# EAGLE design alarm1 (EAGLE 6.3)
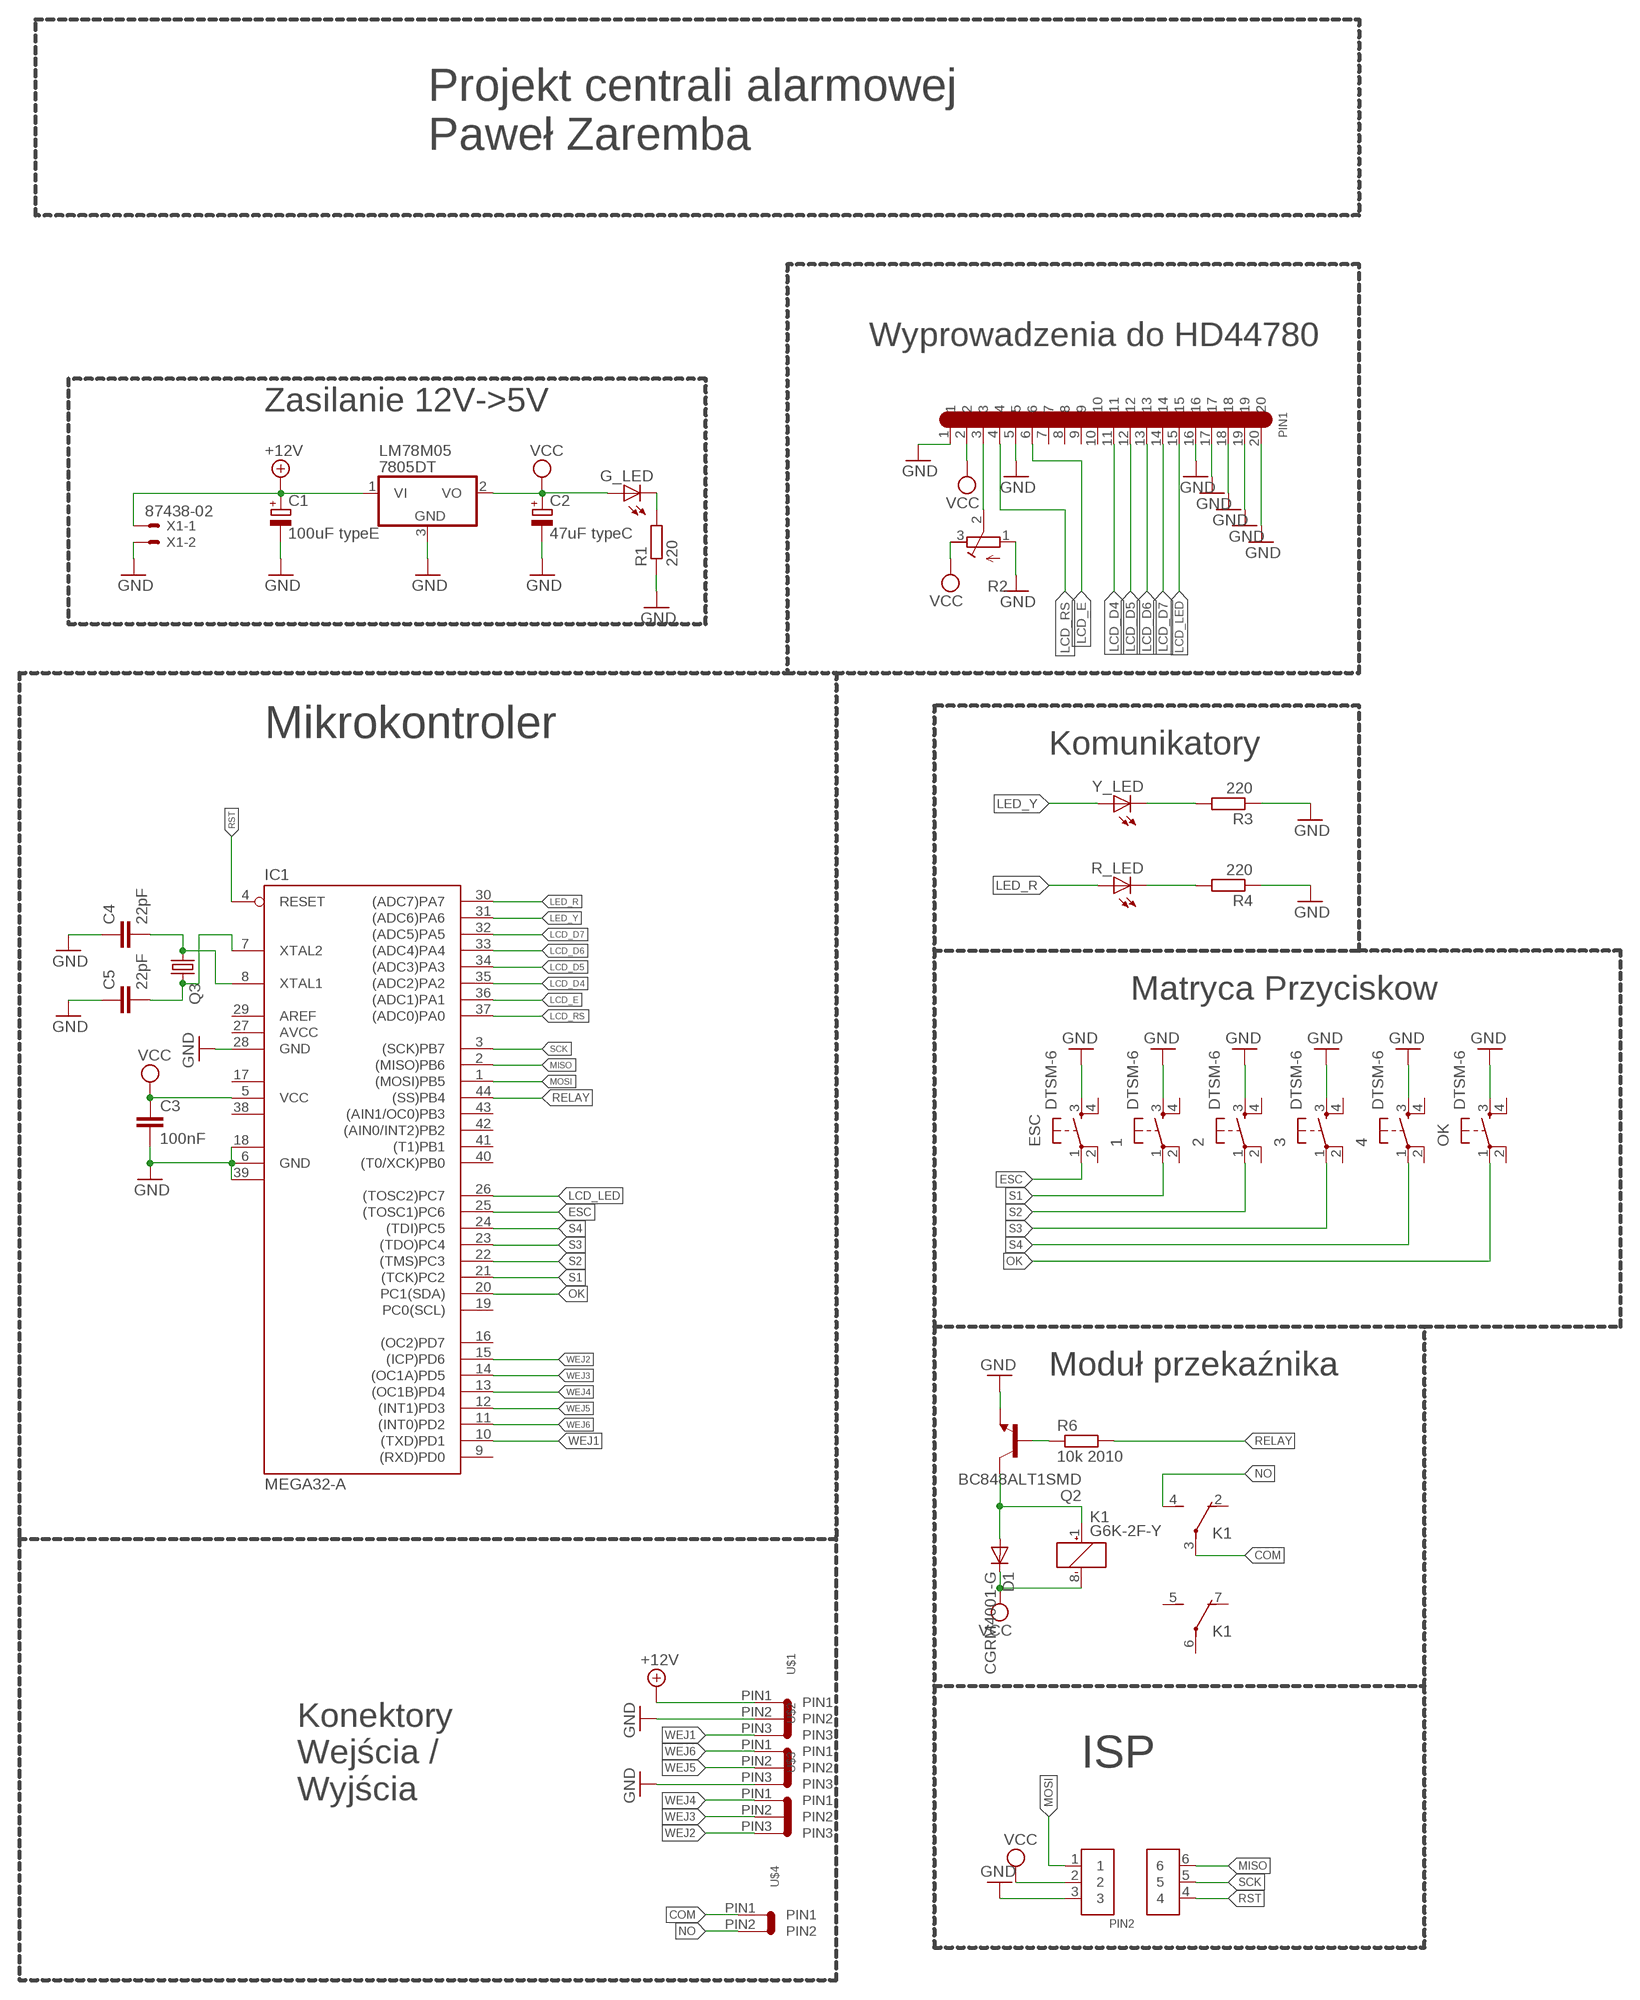
[diagram p0: schematic, sheet 1]

## Parts
1  DTSM-6  [DTSM-6]
2  DTSM-6  [DTSM-6]
3  DTSM-6  [DTSM-6]
4  DTSM-6  [DTSM-6]
C1  100uF typeE  CPOL-EUE  [PANASONIC_E]
C2  47uF typeC  CPOL-EUC  [PANASONIC_C]
C3  100nF  C-EUC1206  [C1206]
C4  22pF  C-EUC1206  [C1206]
C5  22pF  C-EUC1206  [C1206]
D1  CGRM4001-G  [SOD-123_MINI-SMA]
ESC  DTSM-6  [DTSM-6]
G_LED  LEDCHIPLED_1206  [CHIPLED_1206]
IC1  MEGA32-A  [TQFP44]
K1  G6K-2F-Y  [G6K-2F-Y]
LM78M05  7805DT  [TO252]
OK  DTSM-6  [DTSM-6]
PIN1  SINGLE1X20  [SINGLE1X20]
PIN2  2X3_GOLDPIN  [GOLD2X3]
Q2  BC848ALT1SMD  [SOT23]
Q3  CRYSTALHC49UP  [HC49UP]
R1  220  R-EU_R1206  [R1206]
R2  R-TRIMM3314J  [RTRIM3314J]
R3  220  R-EU_R1206  [R1206]
R4  220  R-EU_R1206  [R1206]
R6  10k 2010  R-EU_R2010  [R2010]
R_LED  LEDCHIPLED_1206  [CHIPLED_1206]
U$1  GOLDPIN_SMD_1X3  [GOLDPINSMD1X3]
U$2  GOLDPIN_SMD_1X3  [GOLDPINSMD1X3]
U$3  GOLDPIN_SMD_1X3  [GOLDPINSMD1X3]
U$4  GOLDPIN_SMD_1X2  [GOLDPINSMD1X2]
X1  87438-02  [87438-02]
Y_LED  LEDCHIPLED_1206  [CHIPLED_1206]

## Nets
+12V: C1.+ LM78M05.1(VI) U$1.PIN1 X1.1
COM: K1.3(2:P) U$4.PIN1
CRYSTAL_L: C5.2 IC1.7(XTAL2) Q3.2
CRYSTAL_R: C4.2 IC1.8(XTAL1) Q3.1
ESC: ESC.1 IC1.25((TOSC1)PC6)
GND: 1.3 2.3 3.3 4.3 C1.- C2.- C3.2 C4.1 C5.1 ESC.3 IC1.6(GND) IC1.18(GND1) IC1.28(GND) IC1.39(GND2) LM78M05.3(GND) OK.3 PIN1.1 PIN1.5 PIN1.16 PIN1.17 PIN1.18 PIN1.19 PIN1.20 PIN2.3 Q2.2(E) R1.1 R2.1(E) R3.1 R4.1 U$1.PIN2 U$2.PIN3 X1.2
LCD_D4: IC1.35((ADC2)PA2) PIN1.11
LCD_D5: IC1.34((ADC3)PA3) PIN1.12
LCD_D6: IC1.33((ADC4)PA4) PIN1.13
LCD_D7: IC1.32((ADC5)PA5) PIN1.14
LCD_E: IC1.36((ADC1)PA1) PIN1.6
LCD_LED: IC1.26((TOSC2)PC7) PIN1.15
LCD_RS: IC1.37((ADC0)PA0) PIN1.4
LED_R: IC1.30((ADC7)PA7) R_LED.A
LED_Y: IC1.31((ADC6)PA6) Y_LED.A
MISO: IC1.2((MISO)PB6) PIN2.6
MOSI: IC1.1((MOSI)PB5) PIN2.1
N$1: D1.A K1.1(1:+) Q2.3(C)
N$2: G_LED.C R1.2
N$3: PIN1.3 R2.2(S)
N$4: R3.2 Y_LED.C
N$5: R4.2 R_LED.C
N$7: Q2.1(B) R6.1
NO: K1.4(2:S) U$4.PIN2
OK: IC1.20(PC1(SDA)) OK.1
RELAY: IC1.44((SS)PB4) R6.2
RST: IC1.4(RESET) PIN2.4
S1: 1.1 IC1.21((TCK)PC2)
S2: 2.1 IC1.22((TMS)PC3)
S3: 3.1 IC1.23((TDO)PC4)
S4: 4.1 IC1.24((TDI)PC5)
SCK: IC1.3((SCK)PB7) PIN2.5
VCC: C2.+ C3.1 D1.C G_LED.A IC1.5(VCC) K1.8(1:-) LM78M05.2(VO) PIN1.2 PIN2.2 R2.3(A)
WEJ1: IC1.10((TXD)PD1) U$1.PIN3
WEJ2: IC1.15((ICP)PD6) U$3.PIN3
WEJ3: IC1.14((OC1A)PD5) U$3.PIN2
WEJ4: IC1.13((OC1B)PD4) U$3.PIN1
WEJ5: IC1.12((INT1)PD3) U$2.PIN2
WEJ6: IC1.11((INT0)PD2) U$2.PIN1
Unconnected: 1.2 1.4 2.2 2.4 3.2 3.4 4.2 4.4 ESC.2 ESC.4 IC1.9((RXD)PD0) IC1.16((OC2)PD7) IC1.19(PC0(SCL)) IC1.29(AREF) IC1.40((T0/XCK)PB0) IC1.41((T1)PB1) IC1.42((AIN0/INT2)PB2) IC1.43((AIN1/OC0)PB3) K1.2(2:O) K1.5(3:S) K1.6(3:P) K1.7(3:O) OK.2 OK.4 PIN1.7 PIN1.8 PIN1.9 PIN1.10

## Notes on the sheet
- Projekt centrali alarmowej
  Paweł Zaremba
- Wyprowadzenia do HD44780
- Zasilanie 12V->5V
- Mikrokontroler
- Komunikatory
- Matryca Przyciskow
- Moduł przekaźnika
- ISP
- Konektory
  Wejścia / 
  Wyjścia

## Power pins joined to a net without a drawn wire
AVCC: IC1.27(AVCC)
VCC1: IC1.17(VCC1)
VCC2: IC1.38(VCC2)

## Library data of the parts
1-4 ESC OK = switch-tact:DTSM-6
C1 C2 = resistor:CPOL-EU: POLARIZED CAPACITOR, European symbol
C3-C5 = resistor:C-EU: CAPACITOR, European symbol
D1 = diode:CGRM400*-G: Molded plasitc,JEDEC SOD-123/Mini SMA Source: Comchip CGRM4001-G.pdf
G_LED R_LED Y_LED = led:LED: LED OSRAM: - CHIPLED LG R971, LG N971, LY N971, LG Q971, LY Q971, LO R971, LY R971 LH N974, LH R974 LS Q976, LO Q976, LY Q976 LO Q996 - Hyper CHIPLED LW Q18S LB Q993, LB Q99A, LB R99A - SideLED LS A670, LO A670, LY A670, LG A670, LP A670 LB A673, LV A673, LT A673, LW A673 LH A674 LY A675 LS A676, LA A676, LO A676, LY A676, LW A676 LS A679, LY A679, LG A679 - Hyper Micro SIDELED® LS Y876, LA Y876, LO Y876, LY Y876 LT Y87S - SmartLED LW L88C, LW L88S LB L89C, LB L89S, LG L890 LS L89K, LO L89K, LY L89K LS L896, LA L896, LO L896, LY L896 - TOPLED LS T670, LO T670, LY T670, LG T670, LP T670 LSG T670, LSP T670, LSY T670, LOP T670, LYG T670 LG T671, LOG T671, LSG T671 LB T673, LV T673, LT T673, LW T673 LH T674 LS T676, LA T676, LO T676, LY T676, LB T676, LH T676, LSB T676, LW T676 LB T67C, LV T67C, LT T67C, LS T67K, LO T67K, LY T67K, LW E67C LS E67B, LA E67B, LO E67B, LY E67B, LB E67C, LV E67C, LT E67C LW T67C LS T679, LY T679, LG T679 LS T770, LO T770, LY T770, LG T770, LP T770 LB T773, LV T773, LT T773, LW T773 LH T774 LS E675, LA E675, LY E675, LS T675 LS T776, LA T776, LO T776, LY T776, LB T776 LHGB T686 LT T68C, LB T68C - Hyper Mini TOPLED® LB M676 - Mini TOPLED Santana® LG M470 LS M47K, LO M47K, LY M47K Source: http://www.osram.convergy.de LUXEON: - LUMILED® LXK2-PW12-R00, LXK2-PW12-S00, LXK2-PW14-U00, LXK2-PW14-V00 LXK2-PM12-R00, LXK2-PM12-S00, LXK2-PM14-U00 LXK2-PE12-Q00, LXK2-PE12-R00, LXK2-PE12-S00, LXK2-PE14-T00, LXK2-PE14-U00 LXK2-PB12-K00, LXK2-PB12-L00, LXK2-PB12-M00, LXK2-PB14-N00, LXK2-PB14-P00, LXK2-PB14-Q00 LXK2-PR12-L00, LXK2-PR12-M00, LXK2-PR14-Q00, LXK2-PR14-R00 LXK2-PD12-Q00, LXK2-PD12-R00, LXK2-PD12-S00 LXK2-PH12-R00, LXK2-PH12-S00 LXK2-PL12-P00, LXK2-PL12-Q00, LXK2-PL12-R00 Source: www.luxeon.com KINGBRIGHT: KA-3528ASYC Source: www.kingbright.com
IC1 = atmel:MEGA32: MICROCONTROLLER 32 Kbytes FLASH 2 Kbytes SRAM 1 Kbytes EEPROM USART 8-channel 10 bit ADC Source: www.atmel.com .. doc2503.pdf
K1 = relay:G6K: Low Signal Relay oeiwcsnts1.omron.com/.. D20G6K0100.pdf; MF: OMRON COMPONENTS USA; MPN: G6K-2F-Y DC3; OC_FARNELL: 1690316; OC_NEWARK: 89C6451
LM78M05 = linear:78*: Positive VOLTAGE REGULATOR Source: http://cache.national.com/ds/LM/LM78L05.pdf http://www.fairchildsemi.com/ds/LM/LM7805.pdf
PIN1 = con-pinheaderSMD2,54(gold_pin):SINGLE1X20
PIN2 = con-pinheaderSMD2,54(gold_pin):2X3_GOLDPIN: TE Connectivity GOLDPIN 2,54 grid
Q2 = transistor-npn:BC848*: NPN Transistor
Q3 = crystal:CRYSTAL: CRYSTAL; OC_FARNELL: unknown; OC_NEWARK: unknown
R1 R3 R4 R6 = resistor:R-EU_: RESISTOR, European symbol
R2 = resistor:R-TRIMM: Trimm resistor
U$1-U$3 = con-pinheaderSMD2,54-1x4:GOLDPIN_SMD_1X3
U$4 = con-pinheaderSMD2,54-1x4:GOLDPIN_SMD_1X2
X1 = con-molex:87438-02: Wire-to-Board 1.50mm (.059") Pitch Header - Right Angle, SMT, Shrouded Source: http://www.molex.com/product/micro/87438.html; OC_FARNELL: 1711327; OC_NEWARK: unknown

## Board
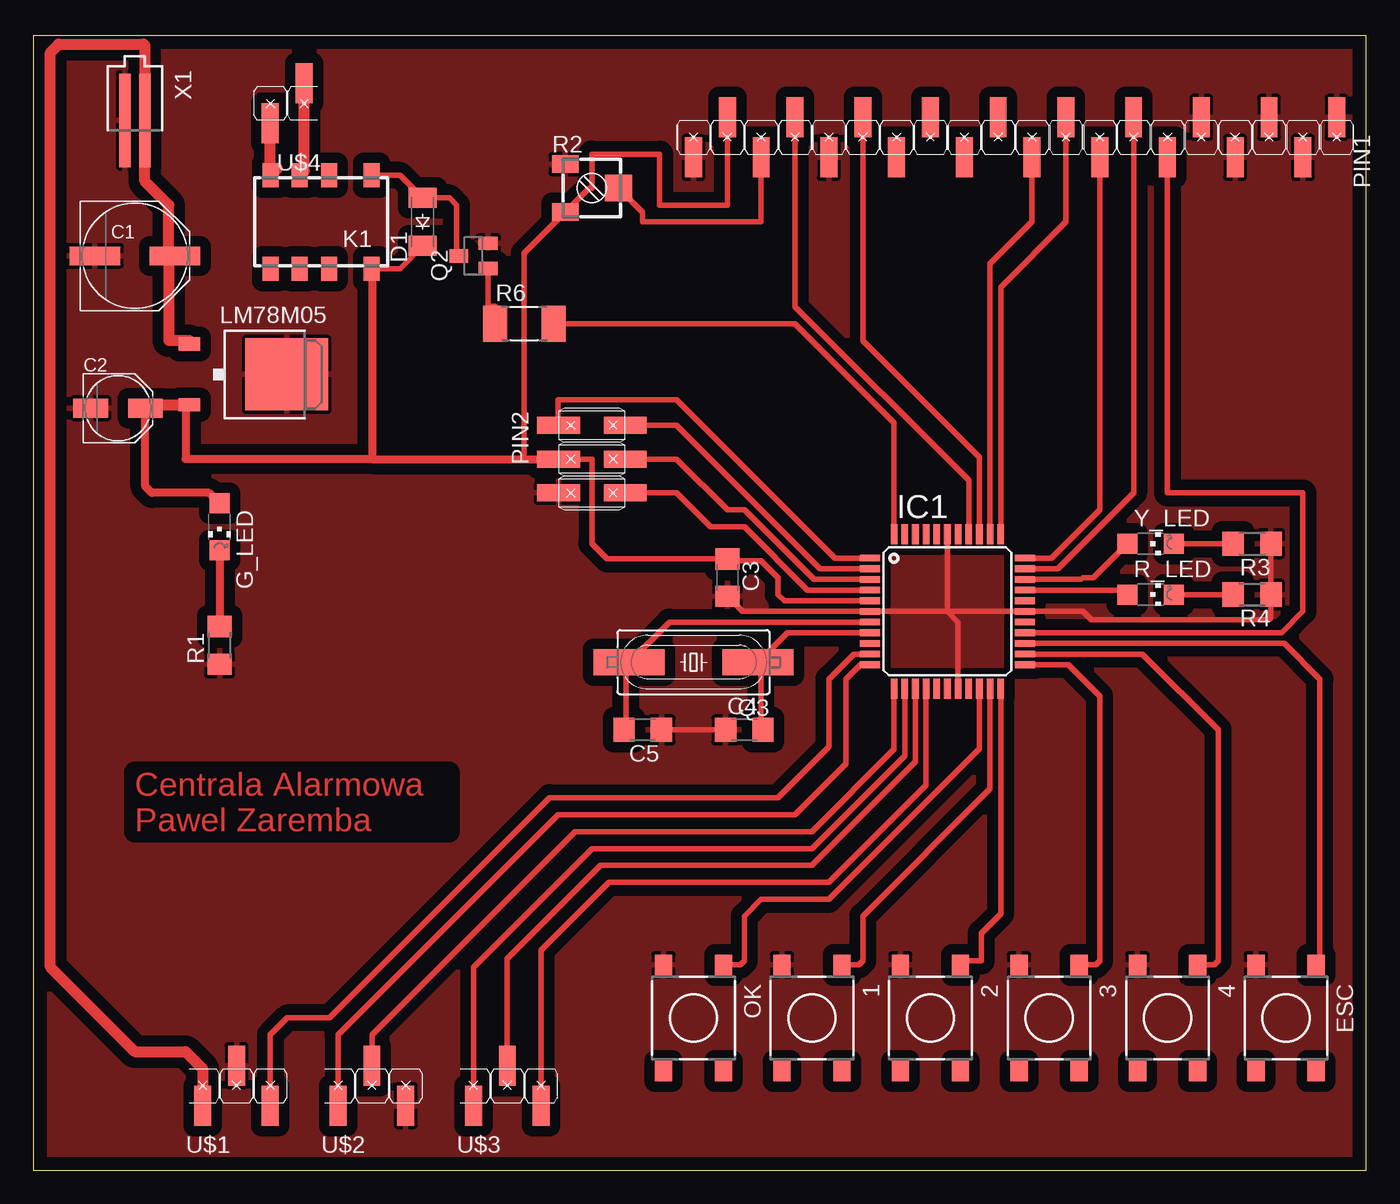
[diagram p1: board, top side]
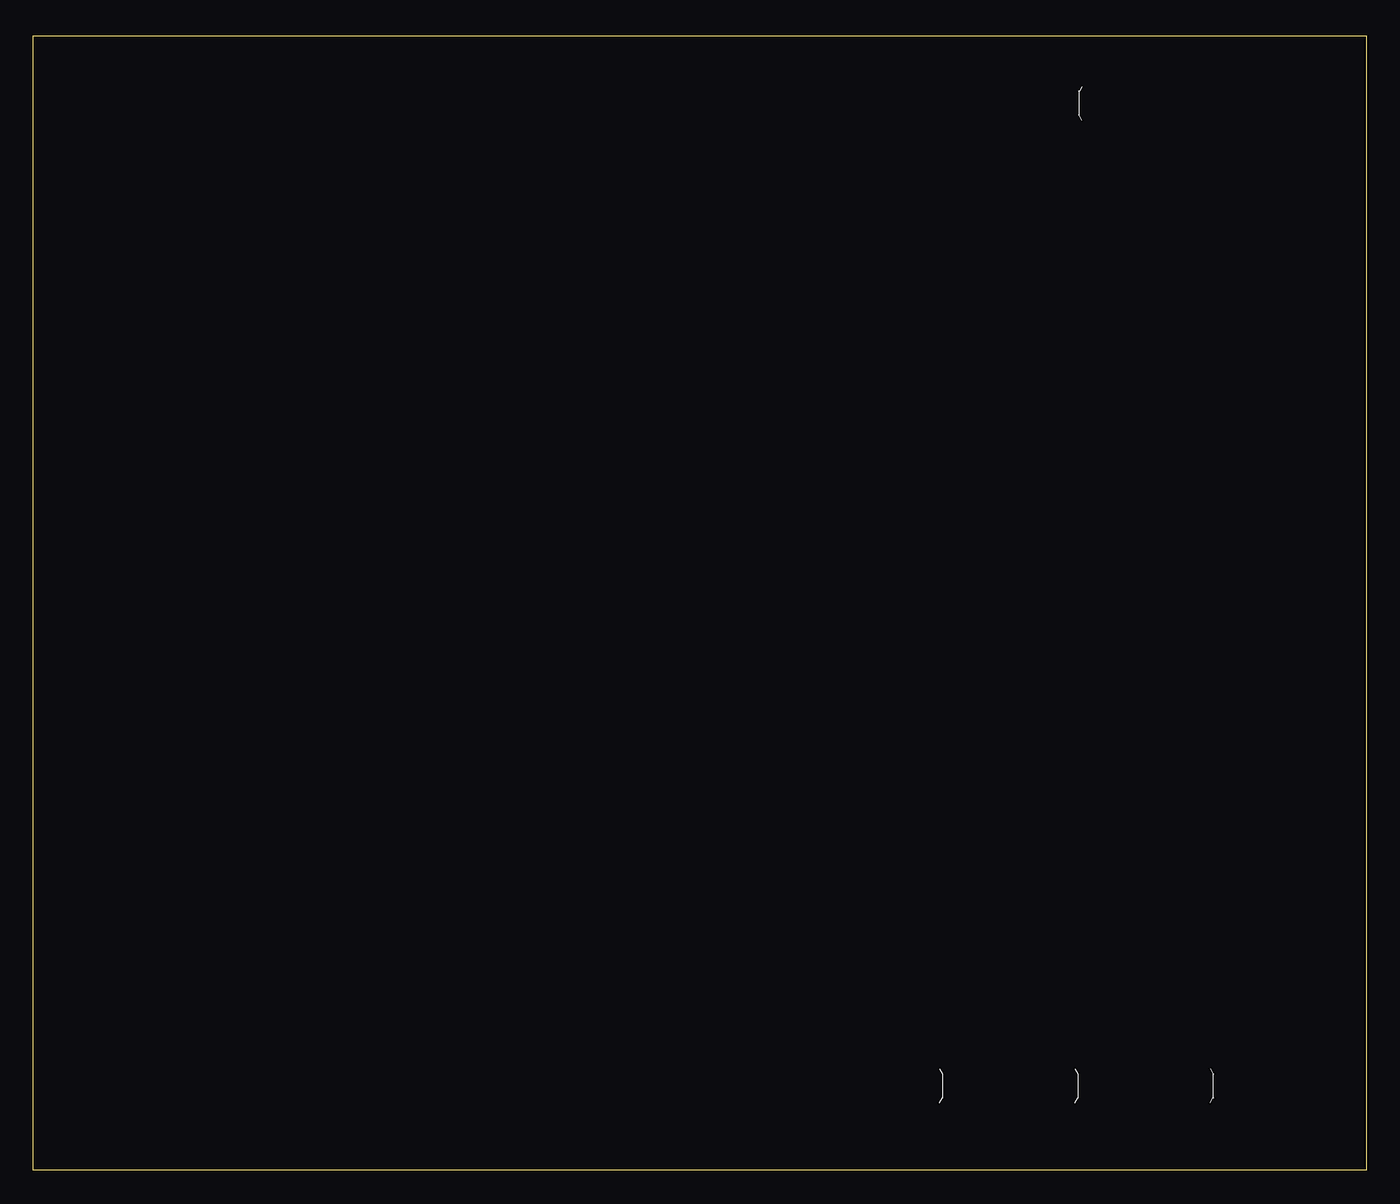
[diagram p2: board, bottom side, seen from below]

Size 100 x 85.08 mm. Coordinates in mm from the lower left corner, seen from the top.
Outline: 0,0 100,0 100,85.08 0,85.08 0,0
Copper layers (1*16): Top 0.035mm / dielectric 1.5mm / Bottom 0.035mm
Design rules "default": minimum track width 10mil, minimum drill 24mil, track to track 8mil, track to pad 8mil, pad to pad 8mil, via to via 8mil, smd to smd 8mil, copper to edge 40mil, drill to drill 8mil, minimum pad ring 10mil, minimum via ring 8mil, stop-mask expansion 4mil, vias tented up to drill 0mil, thermal gap 10mil

### Footprints (pad centres in the part's own frame; a part is rotated, then mirrored left to right if it is on the bottom)
DTSM-6 = smd 1.55 x 1.3: 1 -3.975,2.25; 2 3.975,2.25; 3 -3.975,-2.25; 4 3.975,-2.25
PANASONIC_E = smd 3.8 x 1.4: + 3,0; - -3,0
PANASONIC_C = smd 2.6 x 1.4: + 2.05,0; - -2.05,0
C1206 = smd 1.6 x 1.8: 1 -1.4,0; 2 1.4,0
SOD-123_MINI-SMA = smd 1.5 x 2.1: A 1.8,0; C -1.8,0
CHIPLED_1206 = smd 1.5 x 1.5: A 0,-1.75; C 0,1.75
TQFP44 = smd 1.5 x 0.5: 1 -5.8,4; 2 -5.8,3.2; 3 -5.8,2.4; 4 -5.8,1.6; 5 -5.8,0.8; 6 -5.8,0; 7 -5.8,-0.8; 8 -5.8,-1.6; 9 -5.8,-2.4; 10 -5.8,-3.2; 11 -5.8,-4; 23 5.8,-4; 24 5.8,-3.2; 25 5.8,-2.4; 26 5.8,-1.6; 27 5.8,-0.8; 28 5.8,0; 29 5.8,0.8; 30 5.8,1.6; 31 5.8,2.4; 32 5.8,3.2; 33 5.8,4 | smd 0.5 x 1.5: 12 -4,-5.8; 13 -3.2,-5.8; 14 -2.4,-5.8; 15 -1.6,-5.8; 16 -0.8,-5.8; 17 0,-5.8; 18 0.8,-5.8; 19 1.6,-5.8; 20 2.4,-5.8; 21 3.2,-5.8; 22 4,-5.8; 34 4,5.8; 35 3.2,5.8; 36 2.4,5.8; 37 1.6,5.8; 38 0.8,5.8; 39 0,5.8; 40 -0.8,5.8; 41 -1.6,5.8; 42 -2.4,5.8; 43 -3.2,5.8; 44 -4,5.8
G6K-2F-Y = smd 1.2 x 1.8: 1 -3.8,-3.5; 2 -0.6,-3.5; 3 1.6,-3.5; 4 3.8,-3.5; 5 3.8,3.5; 6 1.6,3.5; 7 -0.6,3.5; 8 -3.8,3.5
TO252 = smd 1 x 1.6: 1 -2.28,-4.8; 2 2.28,-4.8 | smd 5.4 x 6.2: 3 0,2.5
SINGLE1X20 = smd 1.27 x 3: 1 -25.4,-1.5; 2 -22.86,1.5; 3 -20.32,-1.5; 4 -17.78,1.5; 5 -15.24,-1.5; 6 -12.7,1.5; 7 -10.16,-1.5; 8 -7.62,1.5; 9 -5.08,-1.5; 10 -2.54,1.5; 11 0,-1.5; 12 2.54,1.5; 13 5.08,-1.5; 14 7.62,1.5; 15 10.16,-1.5; 16 12.7,1.5; 17 15.24,-1.5; 18 17.78,1.5; 19 20.32,-1.5; 20 22.86,1.5
GOLD2X3 = smd 1.27 x 3.2: 1 -2.54,-2.5; 2 0,-2.5; 3 2.54,-2.5; 4 2.54,2.5; 5 0,2.5; 6 -2.54,2.5
SOT23 = smd 1 x 1.4: 1 -0.95,-1.1; 2 0.95,-1.1; 3 0,1.1
HC49UP = smd 5.334 x 1.93: 1 -4.826,0; 2 4.826,0
R1206 = smd 1.6 x 1.803: 1 -1.422,0; 2 1.422,0
RTRIM3314J = smd 1.3 x 2: 1 -1.8,-2; 3 1.8,-2 | smd 2 x 2: 2 0,2
R2010 = smd 1.8 x 2.7: 1 -2.2,0; 2 2.2,0
GOLDPINSMD1X3 = smd 1.27 x 3: PIN1 -2.54,-1.5; PIN2 0,1.5; PIN3 2.54,-1.5
GOLDPINSMD1X2 = smd 1.27 x 3: PIN1 -1.27,-1.5; PIN2 1.27,1.5
87438-02 = smd 7 x 0.85: 1 0,0.75; 2 0,-0.75

### Placement (x,y rotation side)
1  58.42,11.43 270 top
2  67.31,11.43 270 top
3  76.2,11.43 270 top
4  85.09,11.43 270 top
C1  7.62,68.58 0 top
C2  6.35,57.15 0 top
C3  52.07,44.45 270 top
C4  53.34,33.02 0 top
C5  45.72,33.02 180 top
D1  29.21,71.12 90 top
ESC  93.98,11.43 270 top
G_LED  13.97,48.26 180 top
IC1  68.58,41.91 0 top
K1  21.59,71.12 180 top
LM78M05  16.51,59.69 270 top
OK  49.53,11.43 270 top
PIN1  74.93,77.47 0 top
PIN2  41.91,53.34 270 top
Q2  33.02,68.58 90 top
Q3  49.53,38.1 180 top
R1  13.97,39.37 90 top
R2  41.91,73.66 270 top
R3  91.44,46.99 180 top
R4  91.44,43.18 180 top
R6  36.83,63.5 0 top
R_LED  83.82,43.18 270 top
U$1  15.24,6.35 0 top
U$2  25.4,6.35 0 top
U$3  35.56,6.35 0 top
U$4  19.05,80.01 180 top
X1  7.62,78.74 270 top
Y_LED  83.82,46.99 270 top

### Tracks (layer width: path | path; a pad name or v marks a point on that pad's centre or on a via)
+12V
  Top 0.813: C1.+ 10.16,68.58 | 10.16,68.58 10.16,62.23 11.45,62.23 | 11.45,62.23 11.71,62.23 LM78M05.1 11.45,62.23 | 10.16,68.58 10.16,72.39 8.37,74.18 X1.1 8.37,84.34 8.25,84.45 1.91,84.45 1.27,83.82 1.27,15.24 7.62,8.89 11.43,8.89 12.7,7.62 U$1.PIN1 12.7,3.81
COM
  Top 0.813: 19.8,74.81 K1.3 20.32,74.95 U$4.PIN1
CRYSTAL_L
  Top 0.406: C5.2 44.45,33.15 44.45,38.1 Q3.2 47.71,41.11 IC1.7
CRYSTAL_R
  Top 0.406: C4.2 54.61,33.15 54.61,38.1 Q3.1 56.57,40.31 IC1.8
ESC
  Top 0.406: ESC.1 96.52,15.7 96.52,36.83 93.84,39.51 IC1.25
GND
  Top 0.406: C5.1 C4.1 | C3.2 53.21,41.91 IC1.6 68.58,41.91 | R3.1 R4.1 92.86,41.43 92.71,41.28 79.38,41.28 78.74,41.91 IC1.28 68.58,41.91 | IC1.39 68.58,41.91 | 68.58,41.91 69.38,41.11 IC1.18
  pour Top (isolate 0.813): -2.54,87.63 -2.54,-3.81 104.14,-3.81 104.14,86.36 0,86.36 0,87.63
LCD_D4
  Top 0.406: PIN1.11 74.93,71.12 71.78,67.97 IC1.35
LCD_D5
  Top 0.406: PIN1.12 77.47,71.12 72.58,66.23 IC1.34
LCD_D6
  Top 0.406: PIN1.13 80.01,49.53 76.39,45.91 IC1.33
LCD_D7
  Top 0.406: PIN1.14 82.55,50.8 76.86,45.11 IC1.32
LCD_E
  Top 0.406: PIN1.6 62.23,62.23 70.98,53.48 IC1.36
LCD_LED
  Top 0.406: PIN1.15 85.09,50.8 95.25,50.8 95.25,41.91 93.65,40.31 IC1.26
LCD_RS
  Top 0.406: PIN1.4 57.15,64.77 70.18,51.74 IC1.37
LED_R
  Top 0.406: R_LED.A 81.74,43.51 IC1.30
LED_Y
  Top 0.406: Y_LED.A 79.53,44.45 78.74,44.45 78.6,44.31 IC1.31
MISO
  Top 0.406: PIN2.6 48.26,55.88 59.03,45.11 IC1.2
MOSI
  Top 0.406: PIN2.1 39.37,55.92 39.37,57.79 48.26,57.79 60.13,45.91 IC1.1
N$1
  Top 0.406: K1.1 27.51,74.62 D1.A 31.22,72.92 31.75,72.39 31.75,68.75 Q2.3
N$2
  Top 0.61: G_LED.C R1.2
N$3
  Top 0.406: R2.2 45.72,71.85 45.72,71.12 54.61,71.12 PIN1.3
N$4
  Top 0.406: Y_LED.C R3.2
N$5
  Top 0.406: R_LED.C R4.2
N$7
  Top 0.406: Q2.1 34.12,64.79 34.63,64.79 R6.1
NO
  Top 0.813: 18.3,75.13 K1.4 U$4.PIN2 17.78,78.74
OK
  Top 0.406: IC1.20 70.98,31.61 59.69,20.32 54.61,20.32 53.34,19.05 53.34,15.7 53.05,15.4 OK.1
RELAY
  Top 0.406: IC1.44 64.58,56.07 57.15,63.5 R6.2
RST
  Top 0.406: PIN2.4 48.26,50.8 50.8,48.26 53.34,48.26 58.09,43.51 IC1.4
S1
  Top 0.406: IC1.21 71.78,28.6 62.23,19.05 62.23,15.7 61.94,15.4 1.1
S2
  Top 0.406: IC1.22 72.58,19.24 71.12,17.78 71.12,15.7 69.85,15.7 2.1
S3
  Top 0.406: IC1.23 77.66,37.91 80.01,35.56 80.01,15.7 79.72,15.4 3.1
S4
  Top 0.406: IC1.24 83.21,38.71 88.9,33.02 88.9,15.7 88.61,15.4 4.1
SCK
  Top 0.406: PIN2.5 48.26,53.34 52.07,49.53 53.34,49.53 58.56,44.31 IC1.3
VCC
  Top 0.406: D1.C 27.51,67.62 K1.8 | IC1.5 56.35,42.71 55.88,43.18 55.88,44.45 54.61,45.72 52.2,45.72 C3.1 43.05,45.85 41.91,46.99 41.91,53.34 PIN2.2 38.1,53.34 36.83,53.34 36.83,68.78 R2.3 41.71,73.66 41.91,73.66 41.91,76.2 46.99,76.2 46.99,72.39 52.07,72.39 PIN1.2
  Top 0.61: G_LED.A 13.18,50.8 8.89,50.8 8.4,51.29 C2.+ | LM78M05.2 11.43,57.13 11.43,53.34 25.4,53.34 | K1.8 25.4,53.34 | 25.4,53.34 38.1,53.34
  Top 0.813: C2.+ 8.66,57.41 LM78M05.2
WEJ1
  Top 0.406: IC1.10 61.57,38.71 59.69,36.83 59.69,31.75 55.88,27.94 38.73,27.94 22.23,11.43 19.05,11.43 17.78,10.16 U$1.PIN3 17.78,3.81
WEJ2
  Top 0.406: IC1.15 66.98,28.88 59.69,21.59 43.18,21.59 38.1,16.51 U$3.PIN3 38.1,3.81
WEJ3
  Top 0.406: IC1.14 66.18,30.62 58.42,22.86 42.55,22.86 35.56,15.88 U$3.PIN2
WEJ4
  Top 0.406: IC1.13 65.38,31.09 58.42,24.13 41.91,24.13 33.02,15.24 U$3.PIN1
WEJ5
  Top 0.406: IC1.12 64.58,31.56 58.42,25.4 40.64,25.4 25.4,10.16 U$2.PIN2
WEJ6
  Top 0.406: IC1.11 62.04,37.91 60.96,36.83 60.96,30.48 57.15,26.67 39.37,26.67 22.86,10.16 U$2.PIN1

### Text on the board
Top: Centrala Alarmowa / Pawel Zaremba